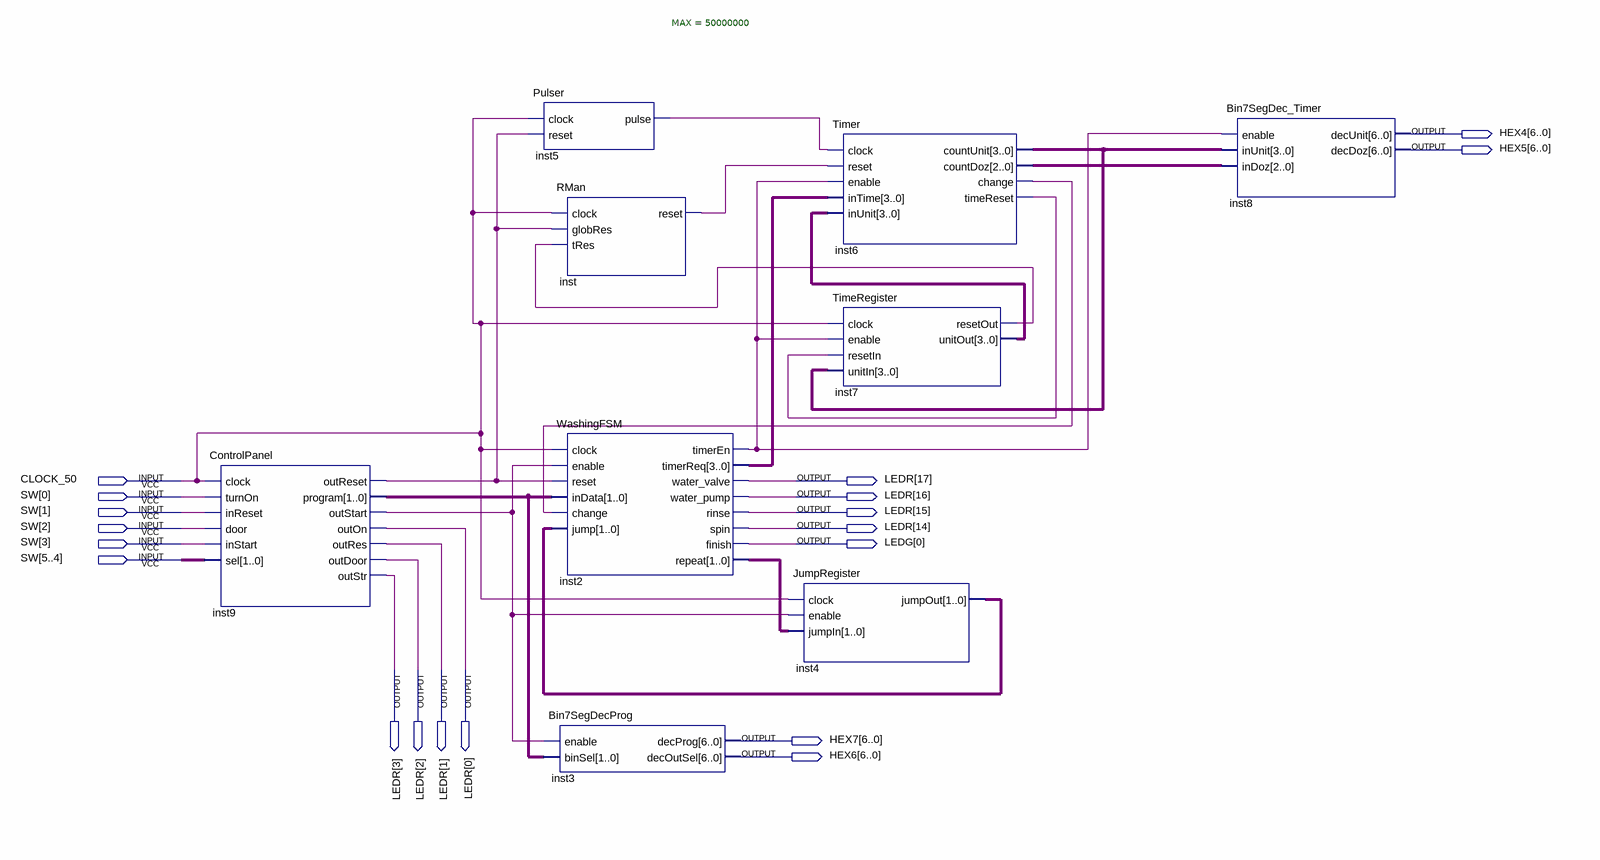
[diagram p0: schematic sheet]
// Quartus schematic WashingMachine_BlocksDiagram_Guide.bdf as structural Verilog: 9 symbols, 19 pins
module WashingMachine_BlocksDiagram_Guide (
  input  CLOCK_50,
  input  [5:0] SW,
  output [6:0] HEX4,
  output [6:0] HEX5,
  output [17:0] LEDR,
  output [0:0] LEDG,
  output [6:0] HEX7,
  output [6:0] HEX6
);

  wire inst2_timeren, inst5_pulse, inst6_change, inst6_timereset, inst7_resetout, inst9_outreset,
       inst9_outstart, inst_reset;
  wire [1:0] inst2_repeat, inst4_jumpout, inst9_program;
  wire [2:0] inst6_countdoz;
  wire [3:0] inst2_timerreq, inst6_countunit, inst7_unitout;

  ControlPanel inst9 (
    .clock(CLOCK_50), .turnOn(SW[0]), .inReset(SW[1]), .door(SW[2]), .inStart(SW[3]), .sel(SW[5:4]),
    .outReset(inst9_outreset), .\program (inst9_program), .outStart(inst9_outstart), .outOn(LEDR[0]),
    .outRes(LEDR[1]), .outDoor(LEDR[2]), .outStr(LEDR[3]));
  Pulser #(.MAX(50000000)) inst5 (.clock(CLOCK_50), .reset(inst9_outreset), .pulse(inst5_pulse));
  Bin7SegDecProg inst3 (.enable(inst9_outstart), .binSel(inst9_program), .decProg(HEX7), .decOutSel(HEX6));
  RMan inst (.clock(CLOCK_50), .globRes(inst9_outreset), .tRes(inst7_resetout), .reset(inst_reset));
  WashingFSM inst2 (
    .clock(CLOCK_50), .enable(inst9_outstart), .reset(inst9_outreset), .inData(inst9_program),
    .change(inst6_change), .jump(inst4_jumpout), .timerEn(inst2_timeren), .timerReq(inst2_timerreq),
    .water_valve(LEDR[17]), .water_pump(LEDR[16]), .rinse(LEDR[15]), .spin(LEDR[14]), .finish(LEDG[0]),
    .\repeat (inst2_repeat));
  JumpRegister inst4 (.clock(CLOCK_50), .enable(inst9_outstart), .jumpIn(inst2_repeat), .jumpOut(inst4_jumpout));
  Timer inst6 (
    .clock(inst5_pulse), .reset(inst_reset), .enable(inst2_timeren), .inTime(inst2_timerreq),
    .inUnit(inst7_unitout), .countUnit(inst6_countunit), .countDoz(inst6_countdoz), .change(inst6_change),
    .timeReset(inst6_timereset));
  TimeRegister inst7 (
    .clock(CLOCK_50), .enable(inst2_timeren), .resetIn(inst6_timereset), .unitIn(inst6_countunit),
    .resetOut(inst7_resetout), .unitOut(inst7_unitout));
  Bin7SegDec_Timer inst8 (
    .enable(inst2_timeren), .inUnit(inst6_countunit), .inDoz(inst6_countdoz), .decUnit(HEX4), .decDoz(HEX5));
endmodule
